# EAGLE design main (EAGLE 9.6.2)
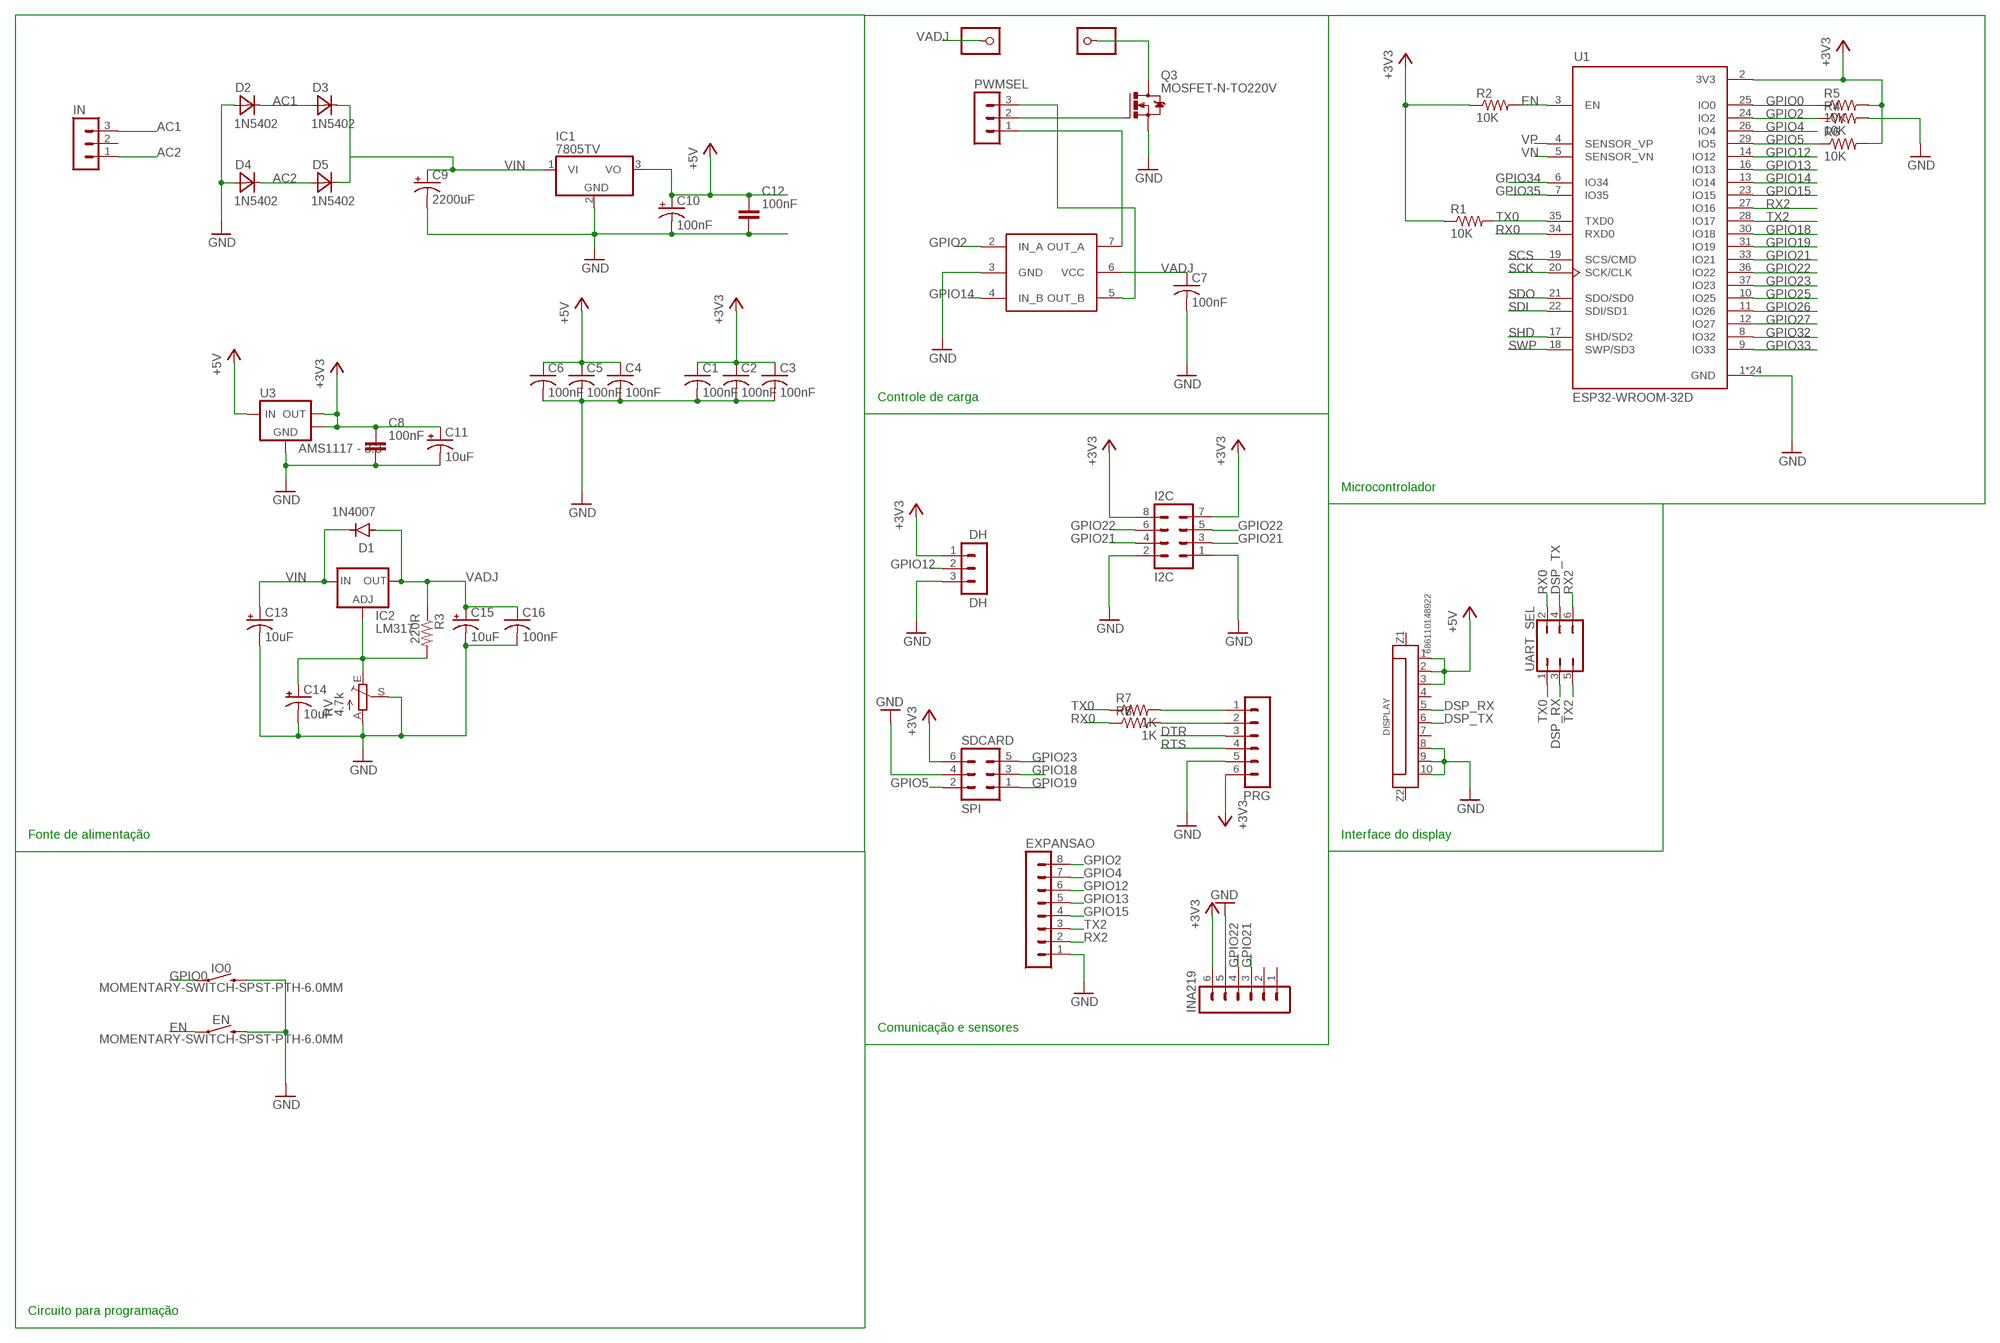
[diagram p0: schematic, sheet 1]

## Parts
C1  100nF  C-USC0805K  [C0805K]
C2  100nF  C-USC0805K  [C0805K]
C3  100nF  C-USC0805K  [C0805K]
C4  100nF  C-USC0805K  [C0805K]
C5  100nF  C-USC0805K  [C0805K]
C6  100nF  C-USC0805K  [C0805K]
C7  100nF  C-USC0805K  [C0805K]
C8  100nF  C_CHIP-0805(2012-METRIC)  [CAPC2012X110]
C9  2200uF  CPOL-5-6MM  [E5-6]
C10  100nF  CPOL-2.54-5MM  [E2,5-5]
C11  10uF  CPOL-2.54-5MM  [E2,5-5]
C12  100nF  C_CHIP-0805(2012-METRIC)  [CAPC2012X110]
C13  10uF  CPOL-USE2-4  [E2-4]
C14  10uF  CPOL-USE2-4  [E2-4]
C15  10uF  CPOL-USE2.5-5  [E2,5-5]
C16  100nF  C-USC0805K  [C0805K]
D1  1N4007  [DO-41]
D2  1N5402  [DO201]
D3  1N5402  [DO201]
D4  1N5402  [DO201]
D5  1N5402  [DO201]
DH  DH  MA03-1  [MA03-1]
DISPLAY  686110148922  6861XX148922_686110148922  [686110148922]
EN  MOMENTARY-SWITCH-SPST-PTH-6.0MM  [TACTILE_SWITCH_PTH_6.0MM]
EXPANSAO  MA08-1  [MA08-1]
I2C  I2C  MA04-2  [MA04-2]
IC1  7805TV  [TO220V]
IC2  LM317  LM317TS  [317TS]
IN  MA03-1  [MA03-1]
INA219  MA06-1  [MA06-1]
IO0  MOMENTARY-SWITCH-SPST-PTH-6.0MM  [TACTILE_SWITCH_PTH_6.0MM]
JP1  PINHD-1X01_2.54-S  [1X01-S]
LOAD  PINHD-1X01_2.54-S  [1X01-S]
PRG  MA06-1  [MA06-1]
PWMSEL  MA03-1  [MA03-1]
Q3  MOSFET-N-TO220V  [TO220BV]
R1  10K  R-US_M0805  [M0805]
R2  10K  R-US_M0805  [M0805]
R3  220R  R0207V-PTH  [0207/5V]
R4  10K  R-US_M0805  [M0805]
R5  10K  R-US_M0805  [M0805]
R6  10K  R-US_M0805  [M0805]
R7  1K  R-US_M0805  [M0805]
R8  1K  R-US_M0805  [M0805]
RV  4.7k  TRIM_EU-RJ9W  [RJ9W]
SDCARD  SPI  MA03-2  [MA03-2]
U1  ESP32-WROOM-32D  [MODULE_ESP32-WROOM-32D]
U2  MC34151  [DIL8]
U3  AMS1117 - 3.3  LM1117-SOT223  [SOT-223-3]
UART_SEL  JP3Q  [JP3Q]

## Nets
+3V3: C1.1 C2.1 C3.1 C8.1 C11.+ DH.1 I2C.7 I2C.8 INA219.6 PRG.6 R1.1 R2.1 R5.2 R6.2 SDCARD.6 U1.2(3V3) U3.2(VOUT) U3.4(HEATSINK)
+5V: C4.1 C5.1 C6.1 C10.+ C12.1 DISPLAY.1 DISPLAY.2 DISPLAY.3 IC1.3(VO) U3.3(VIN)
AC1: D2.C D3.A IN.3
AC2: D4.C D5.A IN.1
DSP_RX: DISPLAY.5 UART_SEL.3
DSP_TX: DISPLAY.6 UART_SEL.4
DTR: PRG.3
EN: EN.1 R2.2 U1.3(EN)
GND: C1.2 C2.2 C3.2 C4.2 C5.2 C6.2 C7.2 C8.2 C9.- C10.- C11.- C12.2 C13.- C14.- C15.- C16.2 D2.A D4.A DH.3 DISPLAY.8 DISPLAY.9 DISPLAY.10 EN.3 EXPANSAO.1 I2C.1 I2C.2 IC1.2(GND) INA219.5 IO0.3 PRG.5 Q3.S R4.2 RV.A RV.S SDCARD.4 U1.1(GND) U1.15(GND) U1.38(GND) U1.39_1(GND) U1.39_2(GND) U1.39_3(GND) U1.39_4(GND) U1.39_5(GND) U1.39_6(GND) U1.39_7(GND) U1.39_8(GND) U1.39_9(GND) U1.39_10(GND) U1.39_11(GND) U1.39_12(GND) U1.39_13(GND) U1.39_14(GND) U1.39_15(GND) U1.39_16(GND) U1.39_17(GND) U1.39_18(GND) U1.39_19(GND) U1.39_20(GND) U1.39_21(GND) U2.3(GND) U3.1(GND)
GPIO0: IO0.1 R5.1 U1.25(IO0)
GPIO2: EXPANSAO.8 R4.1 U1.24(IO2) U2.2(IN_A)
GPIO4: EXPANSAO.7 U1.26(IO4)
GPIO5: R6.1 SDCARD.2 U1.29(IO5)
GPIO12: DH.2 EXPANSAO.6 U1.14(IO12)
GPIO13: EXPANSAO.5 U1.16(IO13)
GPIO14: U1.13(IO14) U2.4(IN_B)
GPIO15: EXPANSAO.4 U1.23(IO15)
GPIO18: SDCARD.3 U1.30(IO18)
GPIO19: SDCARD.1 U1.31(IO19)
GPIO21: I2C.3 I2C.4 INA219.3 U1.33(IO21)
GPIO22: I2C.5 I2C.6 INA219.4 U1.36(IO22)
GPIO23: SDCARD.5 U1.37(IO23)
GPIO25: U1.10(IO25)
GPIO26: U1.11(IO26)
GPIO27: U1.12(IO27)
GPIO32: U1.8(IO32)
GPIO33: U1.9(IO33)
GPIO34: U1.6(IO34)
GPIO35: U1.7(IO35)
N$1: PRG.1 R7.2
N$2: PRG.2 R8.2
N$5: C14.+ IC2.1(ADJ) R3.2 RV.E
N$9: PWMSEL.1 U2.7(OUT_A)
N$10: PWMSEL.3 U2.5(OUT_B)
N$13: LOAD.1 Q3.D
N$14: PWMSEL.2 Q3.G
RTS: PRG.4
RX0: R8.1 U1.34(RXD0) UART_SEL.2
RX2: EXPANSAO.2 U1.27(IO16) UART_SEL.6
SCK: U1.20(SCK/CLK)
SCS: U1.19(SCS/CMD)
SDI: U1.22(SDI/SD1)
SDO: U1.21(SDO/SD0)
SHD: U1.17(SHD/SD2)
SWP: U1.18(SWP/SD3)
TX0: R1.2 R7.1 U1.35(TXD0) UART_SEL.1
TX2: EXPANSAO.3 U1.28(IO17) UART_SEL.5
VADJ: C7.1 C15.+ C16.1 D1.A IC2.2(OUT) JP1.1 R3.1 U2.6(VCC)
VIN: C9.+ C13.+ D1.C D3.C D5.C IC1.1(VI) IC2.3(IN)
VN: U1.5(SENSOR_VN)
VP: U1.4(SENSOR_VP)
Unconnected: DISPLAY.4 DISPLAY.7 DISPLAY.Z1 DISPLAY.Z2 IN.2 INA219.1 INA219.2

## Notes on the sheet
- Controle de carga
- Microcontrolador
- Fonte de alimentação | Interface do display
- Comunicação e sensores
- Circuito para programação

## Library data of the parts
C1-C7 C16 = adafruit:C-US: CAPACITOR, American symbol
C8 C12 = Capacitor:C: Capacitor - Generic; CATEGORY: Capacitor
C9-C11 = bt_rcl:CPOL: Capacitor, Polarized, American symbol
C13-C15 = adafruit:CPOL-US: POLARIZED CAPACITOR, American symbol
D1 = Diodes:1N4007: DIODE GEN PURP 1KV 1A DO41 Manufacturer's datasheet <https://www.mccsemi.com/pdf/Products/1N4001-1N4007(DO-41).pdf>; CREATED_BY: PCBLayout.com; DIGIKEY_PART_NUMBER: 1N4007MSCT-ND; MANUFACTURER: Micro Commercial Co; MPN: 1N4007; PACKAGE: DO-41
D2-D5 = 1N5402:1N5402: Check prices <https://pricing.snapeda.com/parts/1N5402-T/Diodes%20Inc./view-part?ref=eda>; AVAILABILITY: Bad; DESCRIPTION: Diode Standard 200V 3A Through Hole DO-201AD; MF: Diodes Inc.; MP: 1N5402-T; PACKAGE: DO-201 Diodes Inc.; PRICE: None
DH IN PWMSEL = con-lstb:MA03-1: PIN HEADER; OC_FARNELL: unknown; OC_NEWARK: unknown
DISPLAY = Wurth_Connectors_WR-FPC:6861XX148922_686110148922: WR-FPC 1.00 mm SMT ZIF Horizontal - Bottom Contact - Hinge Type KIND PROPERTIES Pitch 1 mm MATERIAL PROPERTIES Insulator Material PA6T Contact Material Phosphor Bronze Contact Plating 120 (µ") Tin over 50 (µ") Nickel Contact Type Stamped Solder Tabs Brass <https://www.we-online.com/catalog/media/o58875v209%20Family_Con_FPC_ZIF_100_6861xx148922.jpg> Details see: https://www.we-online.com/catalog/en/FPC_1_00_SMT_ZIF_HORIZONTAL_BOTTOM_CONTACT_HINGE_TYPE_6861XX148922/ Updated by Ella Wu 2020-08-26 2020(C) Wurth Elektronik; CONTACT-RESISTANCE: 50Ohm; DATASHEET-URL: https://www.we-online.com/catalog/datasheet/686110148922.pdf; IR: 1A; L: 14.6mm; MATE-WITH: WR-FFC 1.00 mm Flat Flexible Cable Type 1 (Contacts on same side)/ Type 2 (Contacts opposite); PACKAGING: Tape and Reel; PART-NUMBER: 686110148922; PINS: 10; PITCH: 1mm; TYPE: Horizontal; WORKING-VOLTAGE: 100V(AC)
EN IO0 = SparkFun-Switches:MOMENTARY-SWITCH-SPST: Momentary Switch (Pushbutton) - SPST Normally-open (NO) SPST momentary switches (buttons, pushbuttons). Variants PTH-12MM - 12mm square, through-hole Momentary Pushbutton Switch - 12mm Square <https://www.sparkfun.com/products/9190> (COM-09190) PTH-6.0MM, PTH-6.0MM-KIT - 6.0mm square, through-hole Mini Pushbutton Switch <https://www.sparkfun.com/products/97> (COM-00097) KIT package intended for soldering kit's - only one side of pads' copper is exposed. PTH-RIGHT-ANGLE-KIT - Right-angle, through-hole Right Angle Tactile Button <https://www.sparkfun.com/products/10791> - Used on SparkFun BigTime Watch Kit <https://www.sparkfun.com/products/11734> SMD-12MM - 12mm square, surface-mount Tactile Button - SMD (12mm) <https://www.sparkfun.com/products/12993> (COM-12993) Used on SparkFun PicoBoard <https://www.sparkfun.com/products/11888> SMD-4.5MM - 4.5mm Square Trackball Switch Used on SparkFun Blackberry Trackballer Breakout <https://www.sparkfun.com/products/13169> SMD-4.6MMX2.8MM - 4.60mm x 2.80mm, surface mount Used on SparkFun SAMD21 Mini Breakout <https://www.sparkfun.com/products/13664> SMD-5.2MM, SMD-5.2-REDUNDANT - 5.2mm square, surface-mount Mini Pushbutton Switch - SMD <https://www.sparkfun.com/products/8720> (COM-08720) Used on Arduino Pro Mini <https://www.sparkfun.com/products/11114> REDUNDANT package connects both switch circuits together SMD-6.0X3.5MM - 6.0 x 3.5mm, surface mount Momentary Reset Switch SMD <https://www.sparkfun.com/products/8229> (COM-08229) SMD-6.2MM-TALL - 6.2mm square, surface mount Tactile Button - SMD (6mm) <https://www.sparkfun.com/products/12992> Used on SparkFun Digital Sandbox <https://www.sparkfun.com/products/12651> SMD-RIGHT-ANGLE - Right-angle, surface mount Used on SparkFun Block for Intel® Edison - Arduino <https://www.sparkfun.com/products/13036>; PROD_ID: SWCH-08441; SF_SKU: COM-00097
EXPANSAO = con-lstb:MA08-1: PIN HEADER; OC_FARNELL: unknown; OC_NEWARK: unknown
I2C = con-lstb:MA04-2: PIN HEADER; OC_FARNELL: unknown; OC_NEWARK: unknown
IC1 = linear:78*: Positive VOLTAGE REGULATOR Source: http://cache.national.com/ds/LM/LM78L05.pdf http://www.fairchildsemi.com/ds/LM/LM7805.pdf
IC2 = v-reg:LM317TS: VOLTAGE REGULATOR
INA219 PRG = con-lstb:MA06-1: PIN HEADER; OC_FARNELL: unknown; OC_NEWARK: unknown
JP1 LOAD = bt_electromech:PINHD-1X01: PIN HEADER Generic pin header in a variety of footprints
Q3 = bt_transistor:MOSFET-N: N-Channel MOSFET
R1 R2 R4-R8 = adafruit:R-US_: RESISTOR, American symbol
R3 = bt_rcl:R: Resistor, American symbol
RV = pot:TRIM_EU-: POTENTIOMETER
SDCARD = con-lstb:MA03-2: PIN HEADER; OC_FARNELL: unknown; OC_NEWARK: unknown
U1 = ESP32-WROOM-32D:ESP32-WROOM-32D: Bluetooth, WiFi 802.11b/g/n, Bluetooth v4.2 + EDR, Class 1, 2 and 3 Transceiver Module 2.4GHz ~ 2.5GHz Integrated, Trace Surface Mount Check prices <https://pricing.snapeda.com/parts/ESP32-WROOM-32D/Espressif%20Systems/view-part?ref=eda>; AVAILABILITY: Bad; DESCRIPTION: Bluetooth, WiFi 802.11b/g/n, Bluetooth v4.2 +EDR, Class 1, 2 and 3 Transceiver Module 2.4GHz ~ 2.5GHz Integrated, Trace Surface Mount; MF: Espressif Systems; MP: ESP32-WROOM-32D; PACKAGE: Module Espressif Systems; PRICE: None
U2 = my_lib1:MC34151
U3 = bt_regulator:LM1117: LDO Voltage Regulator NCP1117 Output Current in Excess of 1.0 A 1.2 V Maximum Dropout Voltage at 800 mA Over Temperature Fixed Output Voltages of 1.5, 1.8, 1.9, 2.0, 2.5, 2.85, 3.3, 5.0, and 12 V Adjustable Output Voltage Option No Minimum Load Requirement for Fixed Voltage Output Devices Reference/Output Voltage Trimmed to ±1.0% Current Limit, Safe Operating and Thermal Shutdown Protection Operation to 20 V Input NCV Prefix for Automotive and Other Applications Requiring Unique Site and Control Change Requirements; AEC−Q100 Qualified and PPAP Capable datasheet.pdf <http://www.onsemi.com/pub/Collateral/NCP1117-D.PDF> LM1117 Available in 1.8 V, 2.5 V, 3.3 V, 5 V, and adjustable versions Output Current 800 mA Current Limiting and Thermal Protection Space-Saving SOT-223 and WSON Packages Line Regulation 0.2% (Maximum) Load Regulation 0.4% (Maximum) Temperature: LM1117: 0°C to 125°C; LM1117I: −40°C to 125°C LM1117 (Rev. N) is a series of low dropout voltage regulators of 1.2V at 800mA of load current. It has the same pin-out as Texas Instruments' industry standard LM317. The LM1117-N is available in an adjustable version, available in five fixed voltages, 1.8V, 2.5V, 2.85V, 3.3V, and 5V. The LM1117-N offers current limiting and thermal shutdown. Its circuit includes a zener trimmed to within ±1%. datasheet.pdf <http://www.ti.com/lit/ds/symlink/lm1117.pdf>
UART_SEL = jumper:JP3Q: JUMPER

## Board
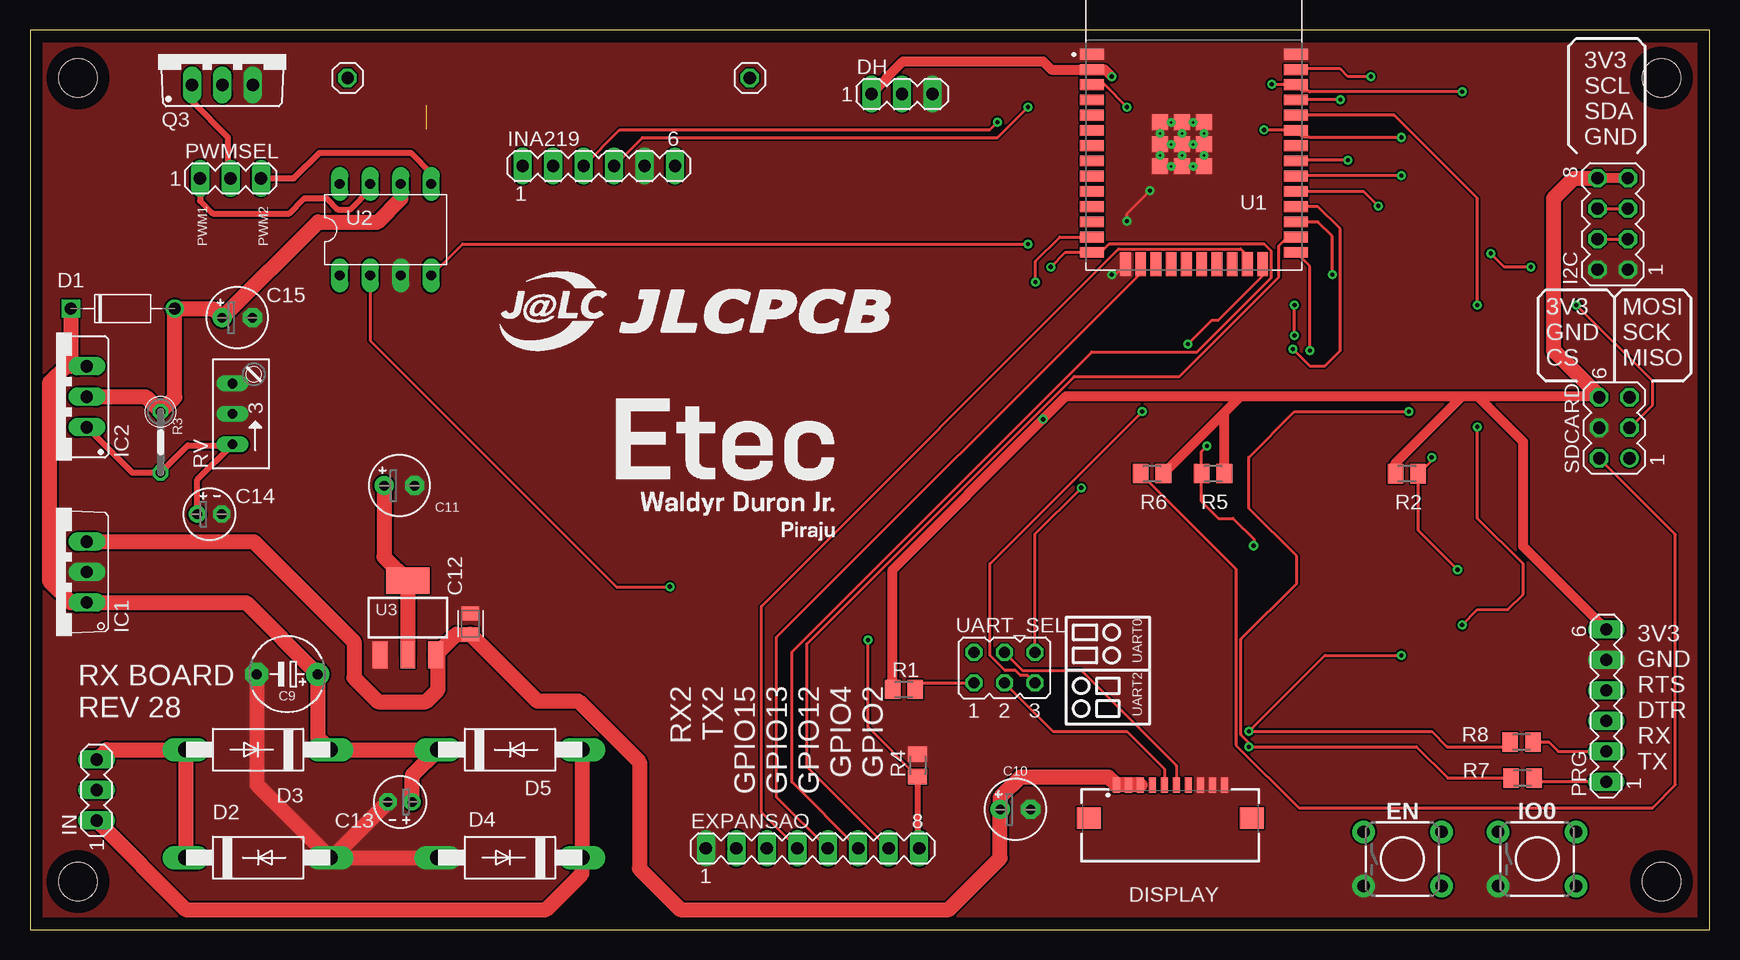
[diagram p1: board, top side]
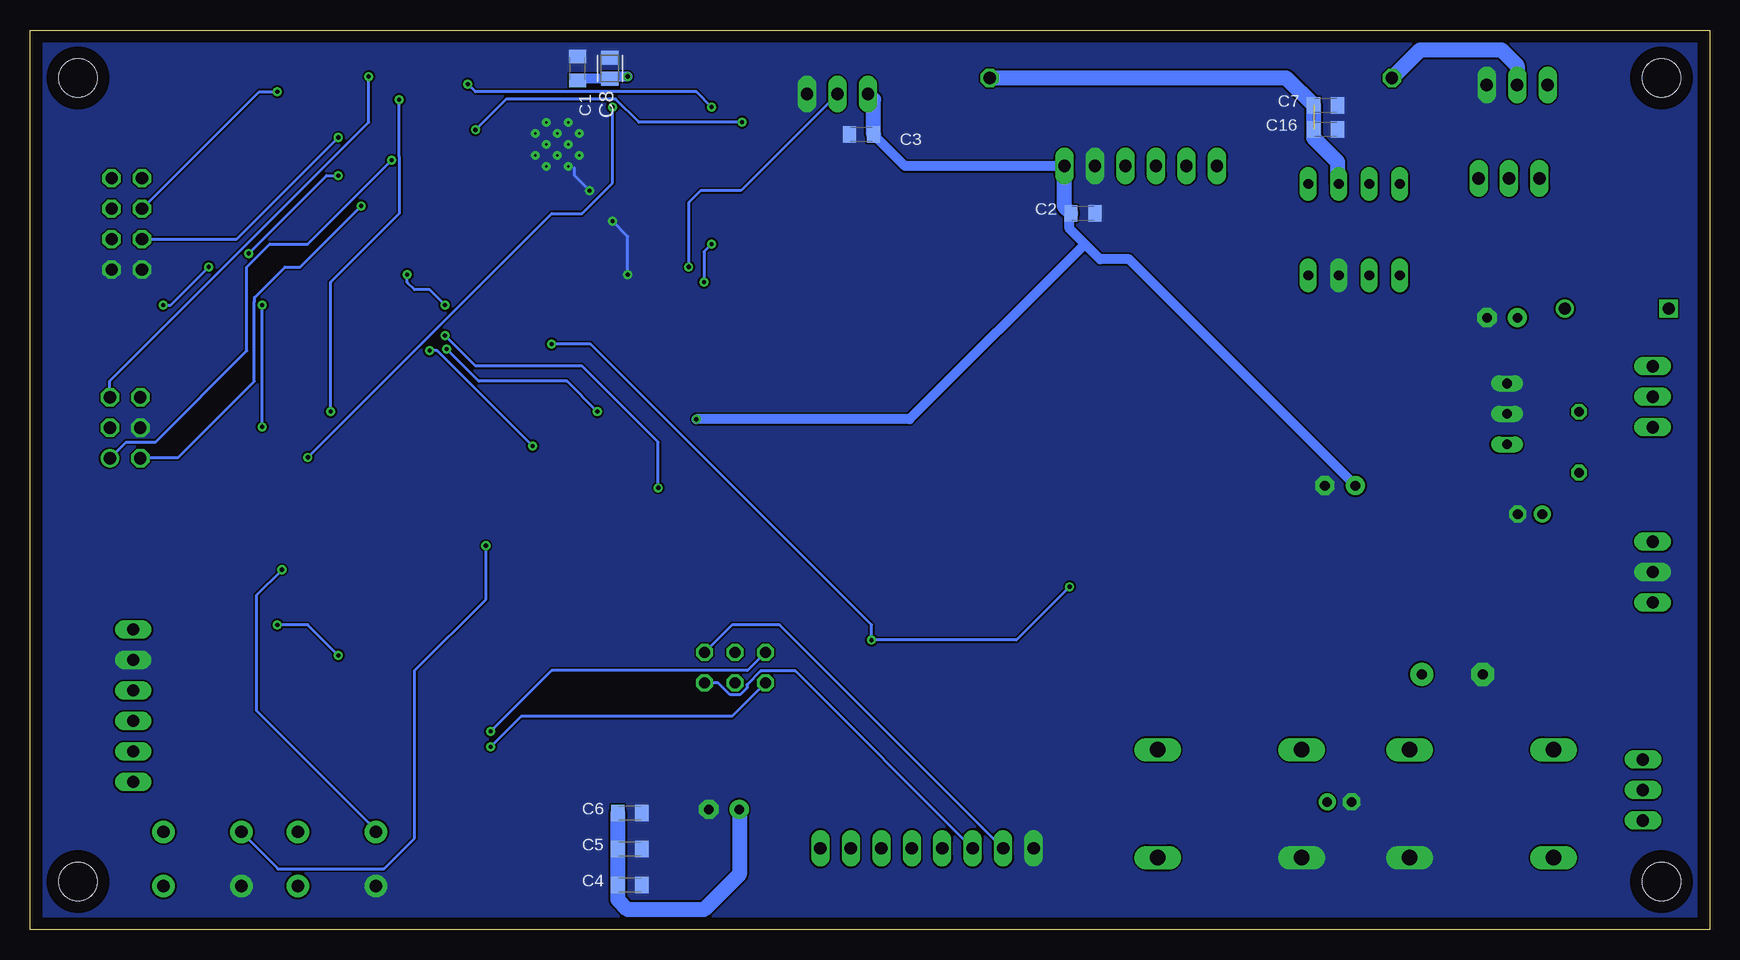
[diagram p2: board, bottom side, seen from below]

Size 140 x 75 mm. Coordinates in mm from the lower left corner, seen from the top.
Outline: 0,0 140,0 140,75 0,75 0,0
Copper layers (1*16): Top 0.035mm / dielectric 1.5mm / Bottom 0.035mm
Design rules "default": minimum track width 6mil, minimum drill 0.35mm, track to track 6mil, track to pad 6mil, pad to pad 6mil, via to via 6mil, smd to smd 6mil, copper to edge 40mil, drill to drill 6mil, minimum pad ring 10mil, minimum via ring 8mil, stop-mask expansion 4mil, vias tented up to drill 0mil, thermal gap 10mil
Holes 3.2 mm at 4,4 4,71 136,71 136,4

### Footprints (pad centres in the part's own frame; a part is rotated, then mirrored left to right if it is on the bottom)
C0805K = smd 1.1 x 1.4: 1 -1,0; 2 1,0
CAPC2012X110 = smd 1.165 x 1.465: 1 -0.875,0; 2 0.875,0
E5-6 = drill 0.813 pad 1.905: + -2.54,0 | drill 0.813 pad 1.905 octagon: - 2.54,0
E2,5-5 = drill 0.813 pad 1.6: + -1.27,0 | drill 0.813 pad 1.6 octagon: - 1.27,0
E2-4 = drill 0.813 pad 1.422: + -1.016,0 | drill 0.813 pad 1.422 octagon: - 1.016,0
DO-41 = drill 1: A 4.325,0 | drill 1 square: C -4.325,0
DO201 = drill 1.3 long: A 6,0; C -6,0
MA03-1 = drill 1.016 long: 1 -2.54,0; 2 0,0; 3 2.54,0
686110148922 = smd 0.6 x 1.3: 1 -4.5,3.35; 2 -3.5,3.35; 3 -2.5,3.35; 4 -1.5,3.35; 5 -0.5,3.35; 6 0.5,3.35; 7 1.5,3.35; 8 2.5,3.35; 9 3.5,3.35; 10 4.5,3.35 | smd 2 x 1.8: Z1 -6.8,0.6; Z2 6.8,0.6
TACTILE_SWITCH_PTH_6.0MM = drill 1.016 pad 1.88: 1 -3.251,2.261; 2 3.251,2.261; 3 -3.251,-2.261; 4 3.251,-2.261
MA08-1 = drill 1.016 long: 1 -8.89,0; 2 -6.35,0; 3 -3.81,0; 4 -1.27,0; 5 1.27,0; 6 3.81,0; 7 6.35,0; 8 8.89,0
MA04-2 = drill 1.016 octagon: 1 -3.81,-1.27; 2 -3.81,1.27; 3 -1.27,-1.27; 4 -1.27,1.27; 5 1.27,-1.27; 6 1.27,1.27; 7 3.81,-1.27; 8 3.81,1.27
TO220V = drill 1.016 long: 1 -2.54,-2.54; 2 0,-2.54; 3 2.54,-2.54
317TS = drill 1.016 long: 1 -2.54,-2.54; 2 0,-2.54; 3 2.54,-2.54
MA06-1 = drill 1.016 long: 1 -6.35,0; 2 -3.81,0; 3 -1.27,0; 4 1.27,0; 5 3.81,0; 6 6.35,0
1X01-S = drill 1.016 octagon: 1 0,0
TO220BV = drill 1.016 long: D 0,0; G -2.54,0; S 2.54,0
M0805 = smd 1.3 x 1.6: 1 -0.95,0; 2 0.95,0
0207/5V = drill 0.813 octagon: 1 -2.54,0; 2 2.54,0
RJ9W = drill 0.813 long: A 2.54,0.635; E -2.54,0.635; S 0,0.635
MA03-2 = drill 1.016: 1 -2.54,-1.27 | drill 1.016 octagon: 2 -2.54,1.27; 3 0,-1.27; 4 0,1.27; 5 2.54,-1.27; 6 2.54,1.27
MODULE_ESP32-WROOM-32D = smd 2 x 0.9: 1 -8.5,5.26; 2 -8.5,3.99; 3 -8.5,2.72; 4 -8.5,1.45; 5 -8.5,0.18; 6 -8.5,-1.09; 7 -8.5,-2.36; 8 -8.5,-3.63; 9 -8.5,-4.9; 10 -8.5,-6.17; 11 -8.5,-7.44; 12 -8.5,-8.71; 13 -8.5,-9.98; 14 -8.5,-11.25; 25 8.5,-11.25; 26 8.5,-9.98; 27 8.5,-8.71; 28 8.5,-7.44; 29 8.5,-6.17; 30 8.5,-4.9; 31 8.5,-3.63; 32 8.5,-2.36; 33 8.5,-1.09; 34 8.5,0.18; 35 8.5,1.45; 36 8.5,2.72; 37 8.5,3.99; 38 8.5,5.26 | smd 0.9 x 2: 15 -5.715,-12.25; 16 -4.445,-12.25; 17 -3.175,-12.25; 18 -1.905,-12.25; 19 -0.635,-12.25; 20 0.635,-12.25; 21 1.905,-12.25; 22 3.175,-12.25; 23 4.445,-12.25; 24 5.715,-12.25 | smd 1.33 x 1.33: 39_1 -2.835,-0.405; 39_2 -1,-0.405; 39_3 0.835,-0.405; 39_4 -2.835,-2.24; 39_5 -1,-2.24; 39_6 0.835,-2.24; 39_7 -2.835,-4.075; 39_8 -1,-4.075; 39_9 0.835,-4.075 | drill 0.2 pad 0.3: 39_10 -1.917,-0.405; 39_11 -0.083,-0.405; 39_12 -2.835,-1.323; 39_13 -1,-1.323; 39_14 0.835,-1.323; 39_15 -1.917,-2.24; 39_16 -0.083,-2.24; 39_17 -2.835,-3.158; 39_18 -1,-3.158; 39_19 0.835,-3.158; 39_20 -1.917,-4.075; 39_21 -0.083,-4.075
DIL8 = drill 0.813 pad 1.422 long: 1 -3.81,-3.81; 2 -1.27,-3.81; 3 1.27,-3.81; 4 3.81,-3.81; 5 3.81,3.81; 6 1.27,3.81; 7 -1.27,3.81; 8 -3.81,3.81
SOT-223-3 = smd 1.219 x 2.235: 1 -2.311,-3.099; 2 0,-3.099; 3 2.311,-3.099 | smd 3.6 x 2.2: 4 0,3.099
JP3Q = drill 0.914 octagon: 1 -2.54,-1.27; 2 -2.54,1.27; 3 0,-1.27; 4 0,1.27; 5 2.54,-1.27; 6 2.54,1.27

### Placement (x,y rotation side)
C1  94.36,71.8 90 bottom
C2  52.24,59.71 0 bottom
C3  70.68,66.29 180 bottom
C4  90,3.71 0 bottom
C5  90,6.71 0 bottom
C6  90,9.71 0 bottom
C7  32,68.71 0 bottom
C8  91.66,71.8 90 bottom
C9  21.44,21.28 180 top
C10  82.14,10.01 0 top
C11  30.79,37.01 0 top
C12  36.72,25.49 90 top
C13  30.85,10.63 180 top
C14  14.96,34.63 0 top
C15  17.28,51.01 0 top
C16  32,66.71 0 bottom
D1  7.74,51.77 0 top
D2  19,6 0 top
D3  19,15 180 top
D4  40,6 180 top
D5  40,15 0 top
DH  72.69,69.66 0 top
DISPLAY  95.05,8.7 0 top
EN  114.41,5.88 0 top
EXPANSAO  65.23,6.77 0 top
I2C  131.93,58.83 90 top
IC1  2.2,29.8 90 top
IC2  2.2,44.42 90 top
IN  5.55,11.63 90 top
INA219  47.41,63.66 0 top
IO0  125.63,5.88 0 top
JP1  60,71 0 top
LOAD  26.47,71 0 top
PRG  131.39,18.66 90 top
PWMSEL  16.71,62.63 0 top
Q3  16.04,70.42 0 top
R1  72.85,20.01 0 top
R2  114.77,38 0 top
R3  10.88,40.63 270 top
R4  73.99,13.69 90 top
R5  98.61,38.01 0 top
R6  93.53,38.01 0 top
R7  124.41,12.63 0 top
R8  124.33,15.63 0 top
RV  17.52,42.99 90 top
SDCARD  132.07,41.83 90 top
U1  97.03,67.71 0 top
U2  29.63,58.35 0 top
U3  31.5,25.99 0 top
UART_SEL  81.23,21.83 0 top

### Tracks (layer width: path | path; a pad name or v marks a point on that pad's centre or on a via)
+3V3  (via drill 0.35)
  Top 0.813: R2.1 113.82,38.89 119.39,44.46 | 119.39,44.46 120.65,44.46 | 120.65,44.46 130.8,44.46 | R6.2 99.56,43.09 | 99.56,43.09 100.93,44.46 | 100.93,44.46 119.39,44.46 | R5.2 99.56,43.09 | R1.1 71.9,29.99 v84.45,42.55 86.37,44.46 100.93,44.46 | v90.17,71.12 89.59,71.7 U1.2 85.14,71.7 84.45,72.39 72.79,72.39 71.37,70.97 71.37,70.88 DH.1 | PRG.6 124.46,31.94 124.46,40.65 120.65,44.46 | I2C.7 I2C.8
  Top 1.27: C11.+ 29.52,31.07 U3.4 U3.2 | SDCARD.6 130.8,44.46 127,48.26 127,60.96 128.68,62.64 I2C.8
  Bottom 0.813: v90.17,71.12 91.47,71.12 C8.1 94.23,70.92 C1.1 | INA219.6 67.05,63.66 C3.1 | C11.+ 48.39,55.88 50.8,55.88 52.07,57.15 | 52.07,57.15 53.34,58.42 53.34,59.69 53.32,59.71 C2.1 | 52.07,57.15 66.67,42.55 v84.45,42.55
  Bottom 1.27: C3.1 69.68,69.19 DH.1 | C2.1 53.76,60.23 INA219.6
+5V
  Top 1.27: IC1.3 18.66,32.34 27,24 27,21 29,19 33,19 34,20 34,22.7 U3.3 35.53,24.61 C12.1 42.28,19.05 45.72,19.05 50.8,13.97 50.8,5.08 54.23,1.65 76.58,1.65 80.87,5.94 C10.+ 80.87,11.02 82.55,12.7 89.9,12.7 DISPLAY.1 DISPLAY.2 DISPLAY.3
  Bottom 1.27: C6.1 C5.1 C4.1 91,2.48 90.17,1.65 83.82,1.65 80.87,4.6 C10.+
AC1
  Top 1.27: IN.3 6.38,15 D3.A D2.C
AC2
  Top 1.27: D5.A D4.C 46,4.65 43,1.65 12.99,1.65 IN.1
DSP_RX
  Top 0.254: UART_SEL.3 85.28,16.51 91.44,16.51 94.55,13.4 DISPLAY.5
DSP_TX
  Top 0.254: UART_SEL.4 82.74,21.59 87.63,21.59 95.55,13.67 DISPLAY.6
DTR
  Top 0.254: PRG.3 131,17.78
EN  (via drill 0.35)
  Top 0.254: v116.84,39.37 116.84,39.12 R2.2 115.72,33.28 v119,30 | U1.3 89.59,70.43 v91.44,68.58
  Bottom 0.254: EN.1 111.16,8.29 121.09,18.22 121.09,27.91 v119,30 | v116.84,39.37 96.52,59.69 93.98,59.69 91.44,62.23 v91.44,68.58
GND  (via drill 0.35)
  Top 0.254: U1.15 90.47,54.61 v90.17,54.61 | v91.44,59.05 91.44,59.69 v93.34,61.59
  Top 1.27: D2.A D4.A | C9.- 18.9,12.1 D2.A | C13.- 25.2,6 D2.A
  Bottom 0.254: v90.17,54.61 90.17,57.78 v91.44,59.05 | v93.34,61.59 94.61,62.87 94.61,63.5
  pour Top (no thermals): 0,0 0,76.2 142.24,76.2 142.24,0
  pour Bottom (no thermals): 0,0 0,76.2 142.24,76.2 142.24,0
GPIO0  (via drill 0.35)
  Top 0.254: v98.11,40.32 97.66,39.87 R5.1 97.66,35.69 99.06,34.29 100.28,34.29 102,32.57 v102,32 | v106.68,48.26 106.68,55.31 U1.25
  Bottom 0.254: IO0.1 119.38,5.14 119.38,5.08 110.49,5.08 107.95,7.62 107.95,21.59 102,27.54 v102,32 | v98.11,40.32 106.06,48.26 v106.68,48.26
GPIO2  (via drill 0.35)
  Top 0.254: R4.1 69.85,16.88 v69.85,24.13 | v96.52,48.81 98.51,50.8 99.06,50.8 102.87,54.61 102.87,55.34 U1.24 | U2.2 28.36,49.11 48.9,28.57 v53.34,28.57
  Top 0.508: R4.1 73.99,6.9 EXPANSAO.8
  Bottom 0.254: v96.52,48.81 93.26,48.81 69.85,25.4 v69.85,24.13 57.78,24.13 v53.34,28.57
GPIO4
  Top 0.254: EXPANSAO.7 64.77,13.58 64.77,23.83 87.05,46.11 95.82,46.11 104.08,54.38 104.08,57.02 104.8,57.73 U1.26
GPIO5  (via drill 0.35)
  Top 0.254: v112.39,60.33 111.18,61.54 U1.29 | R6.1 100.54,30.05 100.54,15.37 105.75,10.16 135.25,10.16 137.16,12.06 137.16,32.93 SDCARD.2
  Bottom 0.254: SDCARD.2 130.72,39.37 127.64,39.37 121.31,45.7 121.31,52.34 121.28,52.37 121.28,52.7 118.75,55.24 117.47,55.24 v112.39,60.33
GPIO12  (via drill 0.35)
  Top 0.254: EXPANSAO.6 63.5,12.31 63.5,23.14 88.52,48.15 97.28,48.15 103.47,54.34 103.47,56.58 102.9,57.15 89.94,57.15 89.26,56.46 U1.14 86.31,56.46 v85.09,55.24
  Bottom 0.254: DH.2 80.73,61.62 84.09,61.62 85.09,60.62 v85.09,55.24
GPIO13
  Top 0.254: EXPANSAO.5 62.23,11.04 62.23,24.38 92.58,54.73 U1.16
GPIO14  (via drill 0.35)
  Top 0.254: U2.4 36.05,57.15 v83.19,57.15 | v83.82,53.98 83.82,55.72 85.83,57.73 U1.13
  Bottom 0.254: v83.19,57.15 83.82,56.52 v83.82,53.98
GPIO15
  Top 0.254: EXPANSAO.4 60.96,9.77 60.96,26.95 90.75,56.74 100.92,56.74 101.47,56.19 U1.23
GPIO18  (via drill 0.35)
  Top 0.254: SDCARD.3 135.25,43.74 135.25,45.72 v128.91,52.07 | v125.09,55.24 122.89,55.24 v121.77,56.37 | v114.3,62.87 105.58,62.87 U1.30
  Bottom 0.254: v128.91,52.07 128.27,52.07 v125.09,55.24 | v121.77,56.37 115.28,62.87 v114.3,62.87
GPIO19  (via drill 0.35)
  Top 0.254: v109.86,64.14 105.58,64.14 U1.31
  Bottom 0.254: SDCARD.1 131.99,40.64 129.54,40.64 121.92,48.26 121.92,55.24 120.02,57.15 116.84,57.15 v109.86,64.14
GPIO21  (via drill 0.35)
  Top 0.254: v114.3,66.04 106.69,66.04 106.65,66.08 106.07,66.08 U1.33 105.47,66.67 v102.87,66.67 | I2C.4 I2C.3 | INA219.3 49.16,66.67 80.01,66.67 v80.64,67.31
  Bottom 0.254: I2C.4 122.78,57.56 v114.3,66.04 | v80.64,67.31 89.24,67.31 91.17,69.24 91.71,69.24 91.73,69.22 100.33,69.22 v102.87,66.67
GPIO22  (via drill 0.35)
  Top 0.254: v119.38,69.85 106.69,69.85 106.65,69.89 106.07,69.89 U1.36 105.47,70.48 v103.5,70.48 | I2C.6 I2C.5 | INA219.4 51.06,66.04 80.64,66.04 v83.19,68.58
  Bottom 0.254: I2C.6 120.91,69.85 v119.38,69.85 | v83.19,68.58 84.45,69.85 102.87,69.85 v103.5,70.48
GPIO23  (via drill 0.35)
  Top 0.254: v111.76,71.12 109.86,71.12 109.22,71.75 105.58,71.75 U1.37
  Bottom 0.254: SDCARD.5 133.34,45.73 111.76,67.31 v111.76,71.12
GPIO26
  Top 0.254: 87.8,60.27 U1.11
N$1
  Top 0.254: PRG.1 125.68,12.31 R7.2
N$2
  Top 0.254: R8.2 126.61,15.63 127.39,14.85 PRG.2
N$5
  Top 0.508: C14.+ 13.94,37.51 16.79,40.36 | 16.79,40.36 RV.E | 16.79,40.36 13.15,40.36 R3.2 8.53,38.09 IC2.1
N$9
  Top 0.508: PWMSEL.1 14.17,60.76 15.24,59.69 21.59,59.69 22.86,60.96 24.73,60.96 25.65,60.04 26.67,60.04 28.36,61.73 U2.7
N$10
  Top 0.508: PWMSEL.3 21.99,62.63 24.13,64.77 31.75,64.77 33.44,63.08 U2.5
N$13
  Bottom 1.27: LOAD.1 24.12,73.35 17.35,73.35 16.04,72.04 Q3.D
N$14
  Top 0.508: PWMSEL.2 16.51,62.83 16.51,66.04 13.5,69.05 Q3.G
RTS
  Top 0.254: PRG.4 131,20.32
RX0  (via drill 0.35)
  Top 0.254: R8.1 122.99,15.24 118.11,15.24 116.84,16.51 v101.6,16.51 107.95,22.86 v114.3,22.86 | v119.38,25.4 120.65,26.67 123.19,26.67 124.46,27.94 124.46,30.48 120.65,34.29 v120.65,41.91 | v120.65,52.07 120.65,60.96 113.72,67.89 U1.34
  Bottom 0.254: UART_SEL.2 80.2,21.59 96.52,21.59 v101.6,16.51 | v114.3,22.86 116.84,25.4 v119.38,25.4 | v120.65,41.91 v120.65,52.07
RX2  (via drill 0.35)
  Top 0.254: UART_SEL.6 83.77,32.97 v87.63,36.83 | v105.41,49.53 v105.41,52.07 | v108.56,54.61 108.56,57.81 107.37,59 U1.27
  Bottom 0.254: v87.63,36.83 87.63,40.64 93.98,46.99 102.87,46.99 v105.41,49.53 | v105.41,52.07 106.68,53.34 107.95,53.34 108.56,53.95 v108.56,54.61 | EXPANSAO.2 77.51,25.4 81.47,25.4 UART_SEL.6
TX0  (via drill 0.35)
  Top 0.254: R1.2 74.35,20.56 UART_SEL.1 | R7.1 118.18,12.63 115.57,15.24 v101.6,15.24 101.6,15.58 100.94,16.24 100.94,24.21 105.58,28.85 105.58,31.13 101.6,35.11 101.6,39.37 105.41,43.18 v114.94,43.18 | v109.22,69.19 105.56,69.19 U1.35
  Bottom 0.254: UART_SEL.1 81.47,17.78 99.06,17.78 v101.6,15.24 | v114.94,43.18 114.94,53.98 109.2,59.71 109.2,64.41 109.22,64.43 v109.22,69.19
TX2  (via drill 0.35)
  Top 0.254: UART_SEL.5 83.15,21.18 82.57,21.18 82.17,21.59 81.28,21.59 80.01,22.86 80.01,30.48 v92.71,43.18 | v105.27,48.4 106.68,46.99 107.95,46.99 109.22,48.26 109.22,58.42 107.37,60.27 U1.28
  Bottom 0.254: v92.71,43.18 95.25,45.72 102.58,45.72 v105.27,48.4 | UART_SEL.5 82.63,20.56 81.64,19.57 80.82,19.57 80.24,20.15 80.24,20.41 79.1,21.55 76.2,21.55 EXPANSAO.3
VADJ  (1 unrouted)
  Top 1.27: U2.6 30.9,60.9 29,59 24,59 C15.+ 15.25,51.77 D1.A 12.06,44.35 R3.1 9.63,44.42 IC2.2
  Bottom 1.27: U2.6 31,62.26 31,64 33,66 C7.1 35.29,71 JP1.1
VIN
  Top 1.27: 3,47 1.65,45.65 1.65,29 3.39,27.26 IC1.1 18,27.26 C9.+ 23.98,16.02 D3.C D5.C 31.87,12.87 C13.+ | 3,47 4.7,47 IC2.3 | D1.C 3.42,47.41 3,47

### Text on the board
tNames: 3V3 / SCL / SDA / GND | PWM1 | PWM2 | 3V3 / GND / CS | MOSI / SCK / MISO | UART0 | RX2 / TX2 / GPIO15 / GPIO13 / GPIO12 / GPIO4 / GPIO2 | UART2 | RX BOARD / REV 28 | 3V3 / GND / RTS / DTR / RX / TX